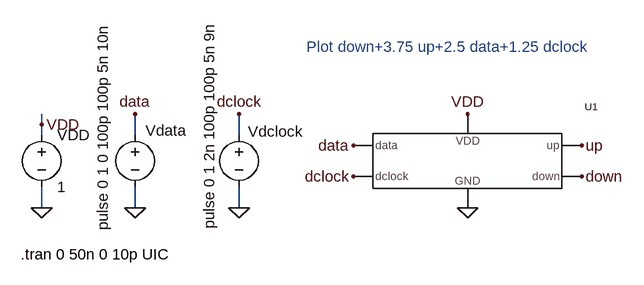
[diagram p0: schematic Fig19_34.asc]
Fig19_34.asc, the LTspice schematic file:
Version 4
SHEET 1 6288 680
WIRE 1264 -528 1264 -544
WIRE 1264 -512 1264 -528
WIRE 1408 -512 1408 -544
WIRE 1568 -512 1568 -544
WIRE 1264 -400 1264 -432
WIRE 1408 -400 1408 -432
WIRE 1568 -400 1568 -432
FLAG 1264 -400 0
FLAG 1264 -528 VDD
FLAG 1920 -400 0
FLAG 1920 -544 VDD
FLAG 2096 -496 up
FLAG 2096 -448 down
FLAG 1744 -496 data
FLAG 1744 -448 dclock
FLAG 1408 -400 0
FLAG 1408 -544 data
FLAG 1568 -400 0
FLAG 1568 -544 dclock
SYMBOL voltage 1264 -528 R0
WINDOW 123 0 0 Left 0
WINDOW 39 0 0 Left 0
SYMATTR InstName VDD
SYMATTR Value 1
SYMBOL PFD 1696 -448 R0
SYMATTR InstName U1
SYMBOL voltage 1408 -528 R0
WINDOW 123 0 0 Left 0
WINDOW 39 0 0 Left 0
WINDOW 0 16 9 Left 0
WINDOW 3 -50 163 VLeft 0
SYMATTR InstName Vdata
SYMATTR Value pulse 0 1 0 100p 100p 5n 10n
SYMBOL voltage 1568 -528 R0
WINDOW 123 0 0 Left 0
WINDOW 39 0 0 Left 0
WINDOW 0 14 11 Left 0
WINDOW 3 -46 161 VLeft 0
SYMATTR InstName Vdclock
SYMATTR Value pulse 0 1 2n 100p 100p 5n 9n
TEXT 1232 -328 Left 0 !.tran 0 50n 0 10p UIC
TEXT 1672 -648 Left 0 ;Plot down+3.75 up+2.5 data+1.25 dclock

The netlist it stands for:
* Fig19_34.asc
VDD VDD 0 1
XU1 data dclock up down VDD 0 PFD  ; pins data dclock up down VDD GND
Vdata data 0 pulse 0 1 0 100p 100p 5n 10n
Vdclock dclock 0 pulse 0 1 2n 100p 100p 5n 9n
.tran 0 50n 0 10p UIC
* Plot down+3.75 up+2.5 data+1.25 dclock
.backanno
.end